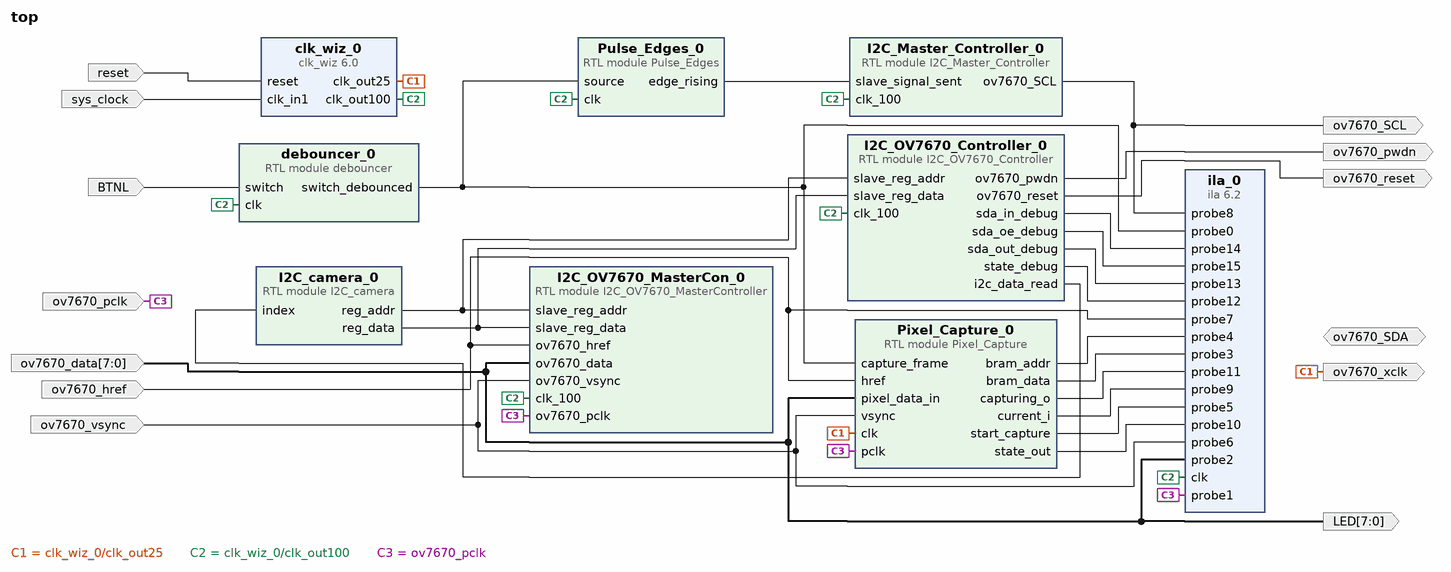
[diagram p0: block diagram of the top level]
# Vivado block design top, xc7a35tcpg236-1, Vivado 2023.2
create_bd_design top

create_bd_port -dir I ov7670_pclk
create_bd_port -dir I -from 7 -to 0 ov7670_data
create_bd_port -dir I ov7670_vsync
create_bd_port -dir I ov7670_href
create_bd_port -dir O ov7670_SCL
create_bd_port -dir IO ov7670_SDA
create_bd_port -dir O ov7670_pwdn
create_bd_port -dir O -type rst ov7670_reset
create_bd_port -dir O -from 7 -to 0 LED
create_bd_port -dir I -type clk sys_clock
set_property -dict {CONFIG.FREQ_HZ 100000000 CONFIG.PHASE 0.0} [get_bd_ports sys_clock]
create_bd_port -dir I -type rst reset
set_property -dict {CONFIG.POLARITY ACTIVE_HIGH} [get_bd_ports reset]
create_bd_port -dir I BTNL
create_bd_port -dir O -type clk ov7670_xclk

create_bd_cell -type ip -vlnv xilinx.com:ip:clk_wiz:6.0 clk_wiz_0
set_property -dict [list \
  CONFIG.CLKOUT1_DRIVES BUFG \
  CONFIG.CLKOUT1_JITTER 137.681 \
  CONFIG.CLKOUT1_PHASE_ERROR 105.461 \
  CONFIG.CLKOUT2_DRIVES BUFG \
  CONFIG.CLKOUT2_JITTER 183.467 \
  CONFIG.CLKOUT2_PHASE_ERROR 105.461 \
  CONFIG.CLKOUT2_REQUESTED_OUT_FREQ 25 \
  CONFIG.CLKOUT2_USED true \
  CONFIG.CLKOUT3_DRIVES BUFG \
  CONFIG.CLKOUT4_DRIVES BUFG \
  CONFIG.CLKOUT5_DRIVES BUFG \
  CONFIG.CLKOUT6_DRIVES BUFG \
  CONFIG.CLKOUT7_DRIVES BUFG \
  CONFIG.CLK_IN1_BOARD_INTERFACE sys_clock \
  CONFIG.CLK_OUT1_PORT clk_out100 \
  CONFIG.CLK_OUT2_PORT clk_out25 \
  CONFIG.MMCM_BANDWIDTH OPTIMIZED \
  CONFIG.MMCM_CLKFBOUT_MULT_F 9 \
  CONFIG.MMCM_CLKOUT0_DIVIDE_F 9 \
  CONFIG.MMCM_CLKOUT1_DIVIDE 36 \
  CONFIG.MMCM_COMPENSATION ZHOLD \
  CONFIG.NUM_OUT_CLKS 2 \
  CONFIG.PRIMITIVE PLL \
  CONFIG.RESET_BOARD_INTERFACE reset \
  CONFIG.USE_BOARD_FLOW true \
] [get_bd_cells clk_wiz_0]
create_bd_cell -type module -reference I2C_camera I2C_camera_0
create_bd_cell -type module -reference I2C_OV7670_MasterController I2C_OV7670_MasterCon_0
create_bd_cell -type module -reference Pixel_Capture Pixel_Capture_0
create_bd_cell -type module -reference debouncer debouncer_0
create_bd_cell -type ip -vlnv xilinx.com:ip:ila:6.2 ila_0
set_property -dict [list \
  CONFIG.C_DATA_DEPTH 16384 \
  CONFIG.C_MONITOR_TYPE Native \
  CONFIG.C_NUM_OF_PROBES 16 \
  CONFIG.C_PROBE12_WIDTH 3 \
  CONFIG.C_PROBE2_WIDTH 8 \
  CONFIG.C_PROBE3_WIDTH 16 \
  CONFIG.C_PROBE4_WIDTH 17 \
  CONFIG.C_PROBE7_WIDTH 1 \
] [get_bd_cells ila_0]
create_bd_cell -type module -reference I2C_OV7670_Controller I2C_OV7670_Controller_0
create_bd_cell -type module -reference Pulse_Edges Pulse_Edges_0
create_bd_cell -type module -reference I2C_Master_Controller I2C_Master_Controller_0

# ---- connections ----

connect_bd_net [get_bd_ports BTNL] [get_bd_pins debouncer_0/switch]
connect_bd_net [get_bd_pins I2C_OV7670_Controller_0/i2c_data_read] [get_bd_pins I2C_camera_0/index]
connect_bd_net [get_bd_pins I2C_OV7670_Controller_0/ov7670_pwdn] [get_bd_ports ov7670_pwdn]
connect_bd_net [get_bd_pins I2C_OV7670_Controller_0/sda_in_debug] [get_bd_pins ila_0/probe14]
connect_bd_net [get_bd_pins I2C_OV7670_Controller_0/sda_oe_debug] [get_bd_pins ila_0/probe15]
connect_bd_net [get_bd_pins I2C_OV7670_Controller_0/sda_out_debug] [get_bd_pins ila_0/probe13]
connect_bd_net [get_bd_pins I2C_OV7670_Controller_0/state_debug] [get_bd_pins ila_0/probe12]
connect_bd_net -net I2C_OV7670_MasterCon_0_ov7670_SCL [get_bd_pins I2C_Master_Controller_0/ov7670_SCL] \
  [get_bd_ports ov7670_SCL] [get_bd_pins ila_0/probe8]
connect_bd_net -net I2C_OV7670_MasterCon_0_ov7670_reset [get_bd_pins I2C_OV7670_Controller_0/ov7670_reset] [get_bd_ports ov7670_reset]
connect_bd_net [get_bd_pins I2C_camera_0/reg_addr] \
  [get_bd_pins I2C_OV7670_MasterCon_0/slave_reg_addr] [get_bd_pins I2C_OV7670_Controller_0/slave_reg_addr]
connect_bd_net [get_bd_pins I2C_camera_0/reg_data] \
  [get_bd_pins I2C_OV7670_MasterCon_0/slave_reg_data] [get_bd_pins I2C_OV7670_Controller_0/slave_reg_data]
connect_bd_net [get_bd_pins Pixel_Capture_0/bram_addr] [get_bd_pins ila_0/probe4]
connect_bd_net [get_bd_pins Pixel_Capture_0/bram_data] [get_bd_pins ila_0/probe3]
connect_bd_net [get_bd_pins Pixel_Capture_0/capturing_o] [get_bd_pins ila_0/probe11]
connect_bd_net [get_bd_pins Pixel_Capture_0/current_i] [get_bd_pins ila_0/probe9]
connect_bd_net [get_bd_pins Pixel_Capture_0/start_capture] [get_bd_pins ila_0/probe5]
connect_bd_net [get_bd_pins Pixel_Capture_0/state_out] [get_bd_pins ila_0/probe10]
connect_bd_net [get_bd_pins Pulse_Edges_0/edge_rising] [get_bd_pins I2C_Master_Controller_0/slave_signal_sent]
connect_bd_net [get_bd_pins clk_wiz_0/clk_out25] [get_bd_ports ov7670_xclk] [get_bd_pins Pixel_Capture_0/clk]
connect_bd_net [get_bd_pins clk_wiz_0/clk_out100] \
  [get_bd_pins debouncer_0/clk] [get_bd_pins ila_0/clk] [get_bd_pins I2C_OV7670_MasterCon_0/clk_100] \
  [get_bd_pins I2C_OV7670_Controller_0/clk_100] [get_bd_pins Pulse_Edges_0/clk] [get_bd_pins I2C_Master_Controller_0/clk_100]
connect_bd_net [get_bd_pins debouncer_0/switch_debounced] \
  [get_bd_pins ila_0/probe0] [get_bd_pins Pixel_Capture_0/capture_frame] [get_bd_pins Pulse_Edges_0/source]
connect_bd_net [get_bd_ports ov7670_data] \
  [get_bd_pins ila_0/probe2] [get_bd_pins Pixel_Capture_0/pixel_data_in] [get_bd_pins I2C_OV7670_MasterCon_0/ov7670_data] \
  [get_bd_ports LED]
connect_bd_net [get_bd_ports ov7670_href] \
  [get_bd_pins ila_0/probe7] [get_bd_pins Pixel_Capture_0/href] [get_bd_pins I2C_OV7670_MasterCon_0/ov7670_href]
connect_bd_net [get_bd_ports ov7670_pclk] \
  [get_bd_pins ila_0/probe1] [get_bd_pins Pixel_Capture_0/pclk] [get_bd_pins I2C_OV7670_MasterCon_0/ov7670_pclk]
connect_bd_net [get_bd_ports ov7670_vsync] \
  [get_bd_pins ila_0/probe6] [get_bd_pins Pixel_Capture_0/vsync] [get_bd_pins I2C_OV7670_MasterCon_0/ov7670_vsync]
connect_bd_net [get_bd_ports reset] [get_bd_pins clk_wiz_0/reset]
connect_bd_net [get_bd_ports sys_clock] [get_bd_pins clk_wiz_0/clk_in1]

validate_bd_design
save_bd_design
